# EAGLE design BNO055+MS5838BoB.v02 (EAGLE 6.4)
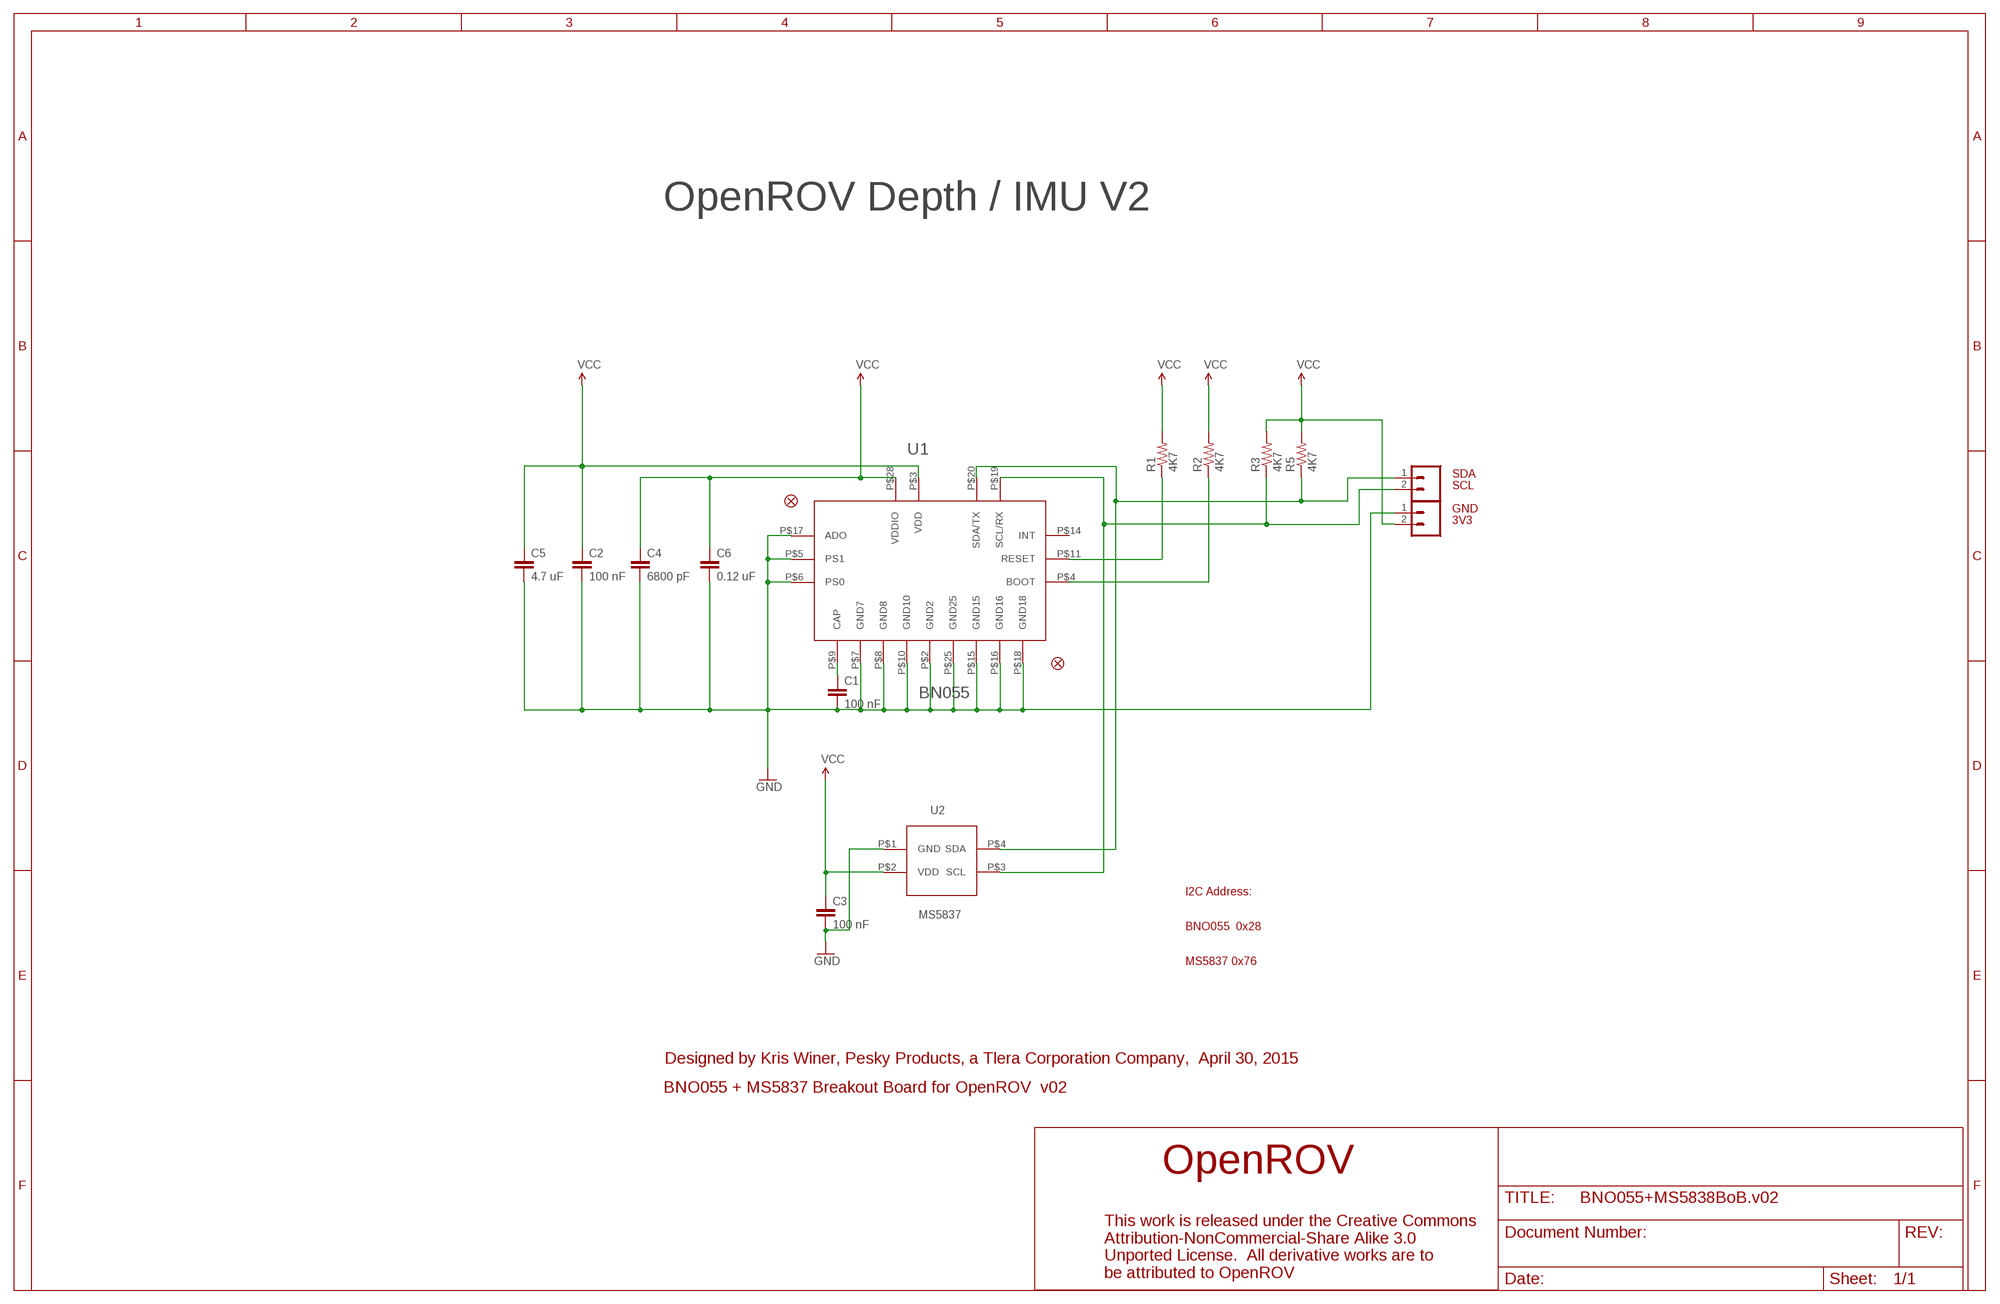
[diagram p0: schematic, sheet 1]

## Parts
C1  100 nF  C-EUC0402  [C0402]
C2  100 nF  C-EUC0402  [C0402]
C3  100 nF  C-EUC0402  [C0402]
C4  6800 pF  C-EUC0402  [C0402]
C5  4.7 uF  C-EUC0402  [C0402]
C6  0.12 uF  C-EUC0402  [C0402]
FID1  FIDUCIALUFIDUCIAL  [MICRO-FIDUCIAL]
FID2  FIDUCIALUFIDUCIAL  [MICRO-FIDUCIAL]
JP2  M021X02_NO_SILK  [1X02_NO_SILK]
JP3  M021X02_NO_SILK  [1X02_NO_SILK]
R1  4K7  R-US_R0402  [R0402]
R2  4K7  R-US_R0402  [R0402]
R3  4K7  R-US_R0402  [R0402]
R5  4K7  R-US_R0402  [R0402]
U1  BN055  [LGA28]
U2  MS5837  [MS5837]

## Nets
GND: C1.2 C2.2 C3.2 C4.2 C5.2 C6.2 JP3.1 U1.P$2(GND2) U1.P$5(PS1) U1.P$6(PS0) U1.P$7(GND7) U1.P$8(GND8) U1.P$10(GND10) U1.P$15(GND15) U1.P$16(GND16) U1.P$17(ADO) U1.P$18(GND18) U1.P$25(GND25) U2.P$1(GND)
N$2: R1.1 U1.P$11(RESET)
N$3: C1.1 U1.P$9(CAP)
N$6: R2.1 U1.P$4(BOOT)
SCL: JP2.2 R3.1 U1.P$19(SCL/RX) U2.P$3(SCL)
SDA: JP2.1 R5.1 U1.P$20(SDA/TX) U2.P$4(SDA)
VCC: C2.1 C3.1 C4.1 C5.1 C6.1 JP3.2 R1.2 R2.2 R3.2 R5.2 U1.P$3(VDD) U1.P$28(VDDIO) U2.P$2(VDD)
Unconnected: U1.P$14(INT)

## Notes on the sheet
- OpenROV Depth / IMU V2
- SDA
- SCL
- GND
- 3V3
- I2C Address:
- BNO055  0x28
- MS5837 0x76
- Designed by Kris Winer, Pesky Products, a Tlera Corporation Company,  April 30, 2015
- BNO055 + MS5837 Breakout Board for OpenROV  v02

## Library data of the parts
C1-C6 = resistor:C-EU: CAPACITOR, European symbol
FID1 FID2 = SparkFun-Aesthetics:FIDUCIAL: Fiducial Alignment Points Various fiducial points for machine vision alignment.
JP2 JP3 = SparkFun-Connectors:M02: Standard 2-pin 0.1" header. Use with - straight break away headers ( PRT-00116) - right angle break away headers (PRT-00553) - swiss pins (PRT-00743) - machine pins (PRT-00117) - female headers (PRT-00115) Molex polarized connector foot print use with: PRT-08233 with associated crimp pins and housings. 2.54_SCREWTERM for use with PRT-10571. 3.5mm Screw Terminal footprints for PRT-08084 5mm Screw Terminal footprints for use with PRT-08433
R1-R3 R5 = rcl:R-US_: RESISTOR, American symbol
U1 = SparkFun-DigitalIC:BN055
U2 = Kris:MS5837: Measurement Specialties' MS5837 Depth Sensor

## Board
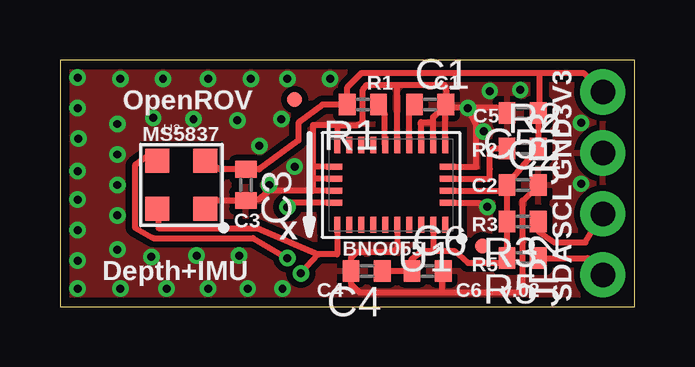
[diagram p1: board, top side]
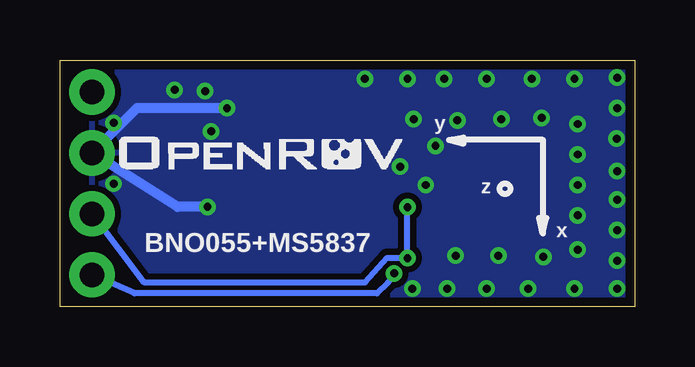
[diagram p2: board, bottom side, seen from below]

Size 23.95 x 10.29 mm. Coordinates in mm from the lower left corner, seen from the top.
Outline: 0,0 23.95,0 23.95,10.29 0,10.29 0,0
Copper layers (1*16): Top 0.0356mm / dielectric 1.5011mm / Bottom 0.0356mm
Design rules "OSHPark *": minimum track width 6mil, minimum drill 13mil, track to track 6mil, track to pad 6mil, pad to pad 6mil, via to via 6mil, smd to smd 6mil, copper to edge 15mil, drill to drill 6mil, minimum pad ring 7mil, minimum via ring 7mil, stop-mask expansion 3mil, vias tented up to drill 20mil, thermal gap 10mil

### Footprints (pad centres in the part's own frame; a part is rotated, then mirrored left to right if it is on the bottom)
C0402 = smd 0.7 x 0.9: 1 -0.65,0; 2 0.65,0
MICRO-FIDUCIAL = smd 0.635 x 0.635: 1 0,0
1X02_NO_SILK = drill 1.016 pad 1.88: 1 0,0; 2 2.54,0
R0402 = smd 0.7 x 0.9: 1 -0.65,0; 2 0.65,0
LGA28 = smd 0.25 x 0.675: P$1 -2.25,1.663; P$6 -2.25,-1.663; P$7 -1.75,-1.663; P$8 -1.25,-1.663; P$9 -0.75,-1.663; P$10 -0.25,-1.663; P$11 0.25,-1.663; P$12 0.75,-1.663; P$13 1.25,-1.663; P$14 1.75,-1.663; P$15 2.25,-1.663; P$20 2.25,1.663; P$21 1.75,1.663; P$22 1.25,1.663; P$23 0.75,1.663; P$24 0.25,1.663; P$25 -0.25,1.663; P$26 -0.75,1.663; P$27 -1.25,1.663; P$28 -1.75,1.663 | smd 0.675 x 0.25: P$2 -2.362,0.75; P$3 -2.362,0.25; P$4 -2.362,-0.25; P$5 -2.362,-0.75; P$16 2.362,-0.75; P$17 2.362,-0.25; P$18 2.362,0.25; P$19 2.362,0.75
MS5837 = smd 1 x 1: P$1 1,-1; P$2 1,1; P$3 -1,1; P$4 -1,-1

### Placement (x,y rotation side)
C1  15.42,8.43 0 top
C2  19.28,5.08 0 top
C3  7.75,5.08 270 top
C4  12.78,1.5 180 top
C5  19.28,8.08 180 top
C6  15.32,1.5 0 top
FID1  9.78,8.64 0 top
FID2  17.6,2.54 0 top
JP2  22.62,1.33 90 top
JP3  22.62,6.41 90 top
R1  12.62,8.43 180 top
R2  19.28,6.6 0 top
R3  19.28,3.56 180 top
R5  19.28,2.03 180 top
U1  13.79,5.08 180 top
U2  5.05,5.08 0 top
U$2  [OROV-LOGO-0.500]  21.89,4.94 0 bottom

### Tracks (layer width: path | path; a pad name or v marks a point on that pad's centre or on a via)
GND  (via drill 0.33)
  Top 0.254: U1.P$6 16.04,8.43 C1.2 | U1.P$7 15.54,7.7 | 15.54,7.7 15.54,7.91 C1.2 | U1.P$8 15.04,7.46 15.04,7.7 15.54,7.7 | U1.P$5 17.35,5.83 17.35,7.54 v16.99,8.28 16.99,8.32 | U1.P$10 14.04,9.24 14.05,9.25 | 14.05,9.25 16.03,9.25 16.1,8.97 16.1,8.32 | U1.P$18 10.54,4.83 | U1.P$17 10.57,5.33 10.54,5.36 | 10.54,5.36 10.54,4.83 | U1.P$16 10.58,5.83 10.54,5.87 | 10.54,5.87 10.54,5.36 | 11.54,7.57 10.54,7.57 10.54,5.87 | U2.P$1 6.3,4.43 C3.2 7.79,4.47 8.26,4.47 8.72,4.83 10.54,4.83 | 11.54,7.57 12.38,7.57 12.62,7.67 12.62,9.04 12.78,9.25 14.05,9.25 | 11.54,7.57 U1.P$15 | U1.P$25 14.04,2.43 13.84,2.29 12.37,2.29 12.12,2.03 12.12,1.41 C4.2 12.12,1.43 12.12,0.97 12.47,0.61 15.93,0.61 | 16.1,8.32 C1.2 | U1.P$2 17.45,4.33 17.6,4.17 v17.8,4.17 | 15.93,0.61 19.28,0.61 19.28,4.43 C2.2 | 15.93,0.61 15.93,1.46 C6.2 | 16.1,8.32 16.99,8.32 | 16.99,8.32 18.19,8.32
  Bottom 0.406: v17.8,4.17 19.05,4.17 JP3.1 20.75,8.28 v16.99,8.28
  other vias: 11.25,9.5 6.17,9.5 7.95,9.5 0.74,8.28 0.74,5.65 0.74,3.2 4.29,9.5 2.51,9.5 2.51,0.76 4.45,0.76 6.17,0.76 9.27,0.76 3.89,7.87 5.56,7.82 7.39,7.77 8.71,5.08 2.39,6.35 2.39,3.81 0.74,9.55 0.74,0.76 3.81,2.08 5.69,2.13 7.47,2.13 9.78,5.84 8.31,6.71 9.22,7.82 9.47,9.5 2.39,2.39 2.39,5.08 2.39,7.62 19.18,9.04 17.91,8.99 17.65,7.32 0.76,7.01 0.74,4.47 0.74,1.93 7.82,0.76 21.72,7.67 21.72,5.13
  pour Bottom (isolate 0.254): 0.03,10.13 23.95,10.24 23.95,0.08 0.03,-0.03
  pour Top (isolate 0.254): 0.03,10.16 23.95,10.21 23.95,0.05 17.09,0 17.09,7.62 10.54,7.62 10.54,5.33 6.99,5.33 6.93,7.01 3.17,7.01 3.17,3.2 6.93,3.2 6.93,5.13 10.54,5.13 10.59,2.59 16.99,2.59 16.94,0 0.03,0
N$2
  Top 0.254: U1.P$11 13.54,8.02 R1.1
N$3
  Top 0.254: U1.P$9 14.54,8 C1.1
N$6
  Top 0.254: U1.P$4 17.9,5.33 17.91,5.74 17.91,6.45 18.06,6.6 R2.1
SCL  (via drill 0.33)
  Top 0.254: U2.P$3 3.56,6.23 3.12,5.89 3.12,3.3 3.89,2.87 8.05,2.87 v9.47,2.03 | U1.P$19 9.63,4.33 v9.47,4.16 | R3.1 19.93,3.16 20.6,2.69 21.89,2.69 JP2.2
  Bottom 0.254: v9.47,4.16 v9.47,2.03 9.64,2.05 10.32,2.05 11.25,1.02 20.43,1.02 JP2.2
SDA  (via drill 0.33)
  Top 0.254: U1.P$20 11.54,2.18 10.77,2.18 | 10.77,2.18 v10.03,1.4 | 10.77,2.18 8.23,3.28 4.11,3.28 U2.P$4 | R5.1 21.98,2.03 JP2.1
  Bottom 0.254: v10.03,1.4 10.08,1.3 10.29,1.02 10.74,0.56 20.84,0.56 JP2.1
VCC
  Top 0.254: C2.1 R3.2 R5.2 18.48,1.83 16.99,1.83 16.43,2.34 15.52,2.34 | U1.P$3 18.28,4.83 C2.1 | C2.1 19.09,5.66 R2.2 | U2.P$2 6.66,5.73 C3.1 8.29,5.73 9.93,6.93 9.93,7.67 10.95,8.43 R1.2 11.97,9.15 12.57,9.75 19.99,9.75 | 14.64,1.52 C6.1 | U1.P$28 15.54,2.36 15.52,2.34 | C6.1 14.66,1.44 14.66,1.98 15.11,2.34 15.52,2.34 | C4.1 C6.1 | 19.77,6.71 R2.2 | 19.99,9.75 21.82,9.75 JP3.2 | 19.99,9.75 19.99,8.08 C5.1 R2.2

### Text on the board
tPlace: R1 | C1 | OpenROV | C5 | 3V3 | MS5837 | R2 | C2 | SCL | GND | C3 | x | R3 | SDA | BNO055 | R5 | Depth+IMU | C4 | C6 | v.02
bPlace: y | z | x | BNO055+MS5837